# Altium schematic sheet BGA LEDs A.SchDoc: Schematic Sheet Test Title
size 289 x 193 mm; Organization: CXQ; Address1: RM 7401, 550 Jumen Rd, Huangpu District, Shanghai, China; Address2: Huangpu District; Address3: Shanghai; Address4: China; Revision: MB0004-01.A.1; SheetNumber: 1; SheetTotal: 99; PageSetup: Record=PageOptions|CenterHorizontal=True|CenterVertical=True|PrintScale=0.98|XCorrection=1.00|YCorrection=1.00|PrintKind=0|BorderSize=5000000|LeftOffset=0|BottomOffset=0|Orientation=2|PaperLength=1000|PaperWidth=1000|Scale=100|PaperSource=7|PrintQuality=-4|MediaType=1|DitherType=10|PaperKind=A4|PrintScaleMode=1; ProjectName: Project Name
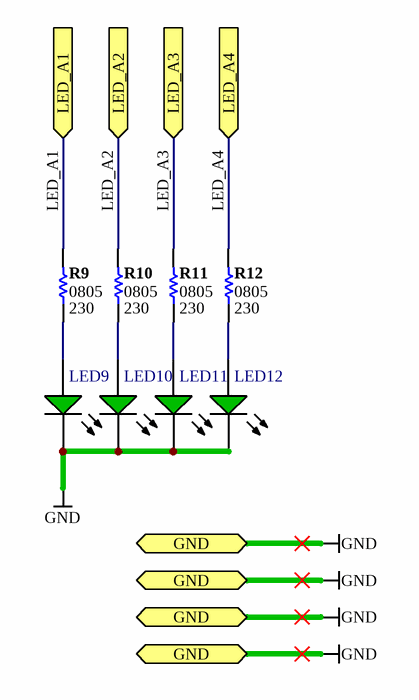
[diagram p0: BGA LEDs A.SchDoc]

## Parts
LED9  LED_1206  [RESC0805(2012)70_L]  (value not drawn)
LED10  LED_1206  [RESC0805(2012)70_L]  (value not drawn)
LED11  LED_1206  [RESC0805(2012)70_L]  (value not drawn)
LED12  LED_1206  [RESC0805(2012)70_L]  (value not drawn)
R9  0805  Value (Ohms): 230  [RESC0805(2012)70_L]
R10  0805  Value (Ohms): 230  [RESC0805(2012)70_L]
R11  0805  Value (Ohms): 230  [RESC0805(2012)70_L]
R12  0805  Value (Ohms): 230  [RESC0805(2012)70_L]

## Ports
GND, LED_A1 (in), LED_A2 (in), LED_A3 (in), LED_A4 (in)

## Nets
GND: LED9.2(K) LED10.2(K) LED11.2(K) LED12.2(K) ; port GND
LED_A1: R9.2 ; port LED_A1
LED_A2: R10.2 ; port LED_A2
LED_A3: R11.2 ; port LED_A3
LED_A4: R12.2 ; port LED_A4
NetLED9_1: LED9.1(A) R9.1
NetLED10_1: LED10.1(A) R10.1
NetLED11_1: LED11.1(A) R11.1
NetLED12_1: LED12.1(A) R12.1

## Notes on the sheet
- A4
- DOCUMENT
- DATE
- TIME
- of
- SHEET
- ADDR
- FILE
- RM 7401, 550 Jumen Road
- Huangpu District, Shanghai, China
- www.mesheven.com

## Library data of the parts
LED9-LED12 = CMP-0201-0036: GREEN color, 1206, SMD; Manufacturer_PN: 1206-LED-GREEN; DefaultDesignator: LED?; Class: Diodes; Sub Class: LED; ID: CMP-0201-0036; Reverse Voltage DC (Vr): Green; ComponentLink1Description: Datasheet; ComponentLink2Description: Manufacturer
R9-R12 = CMP-0501-0000: Jumper 0805 (2012 Metric); Value: 0R; Case-Metric: 2012; Temp Coefficient ppm/°C: None; ID: CMP-0501-0000; Case-EIA: 0805; Tolerance %: None; Power: None; Technology: SMT